# Altium project Tra_doantotnghiep.PrjPcb
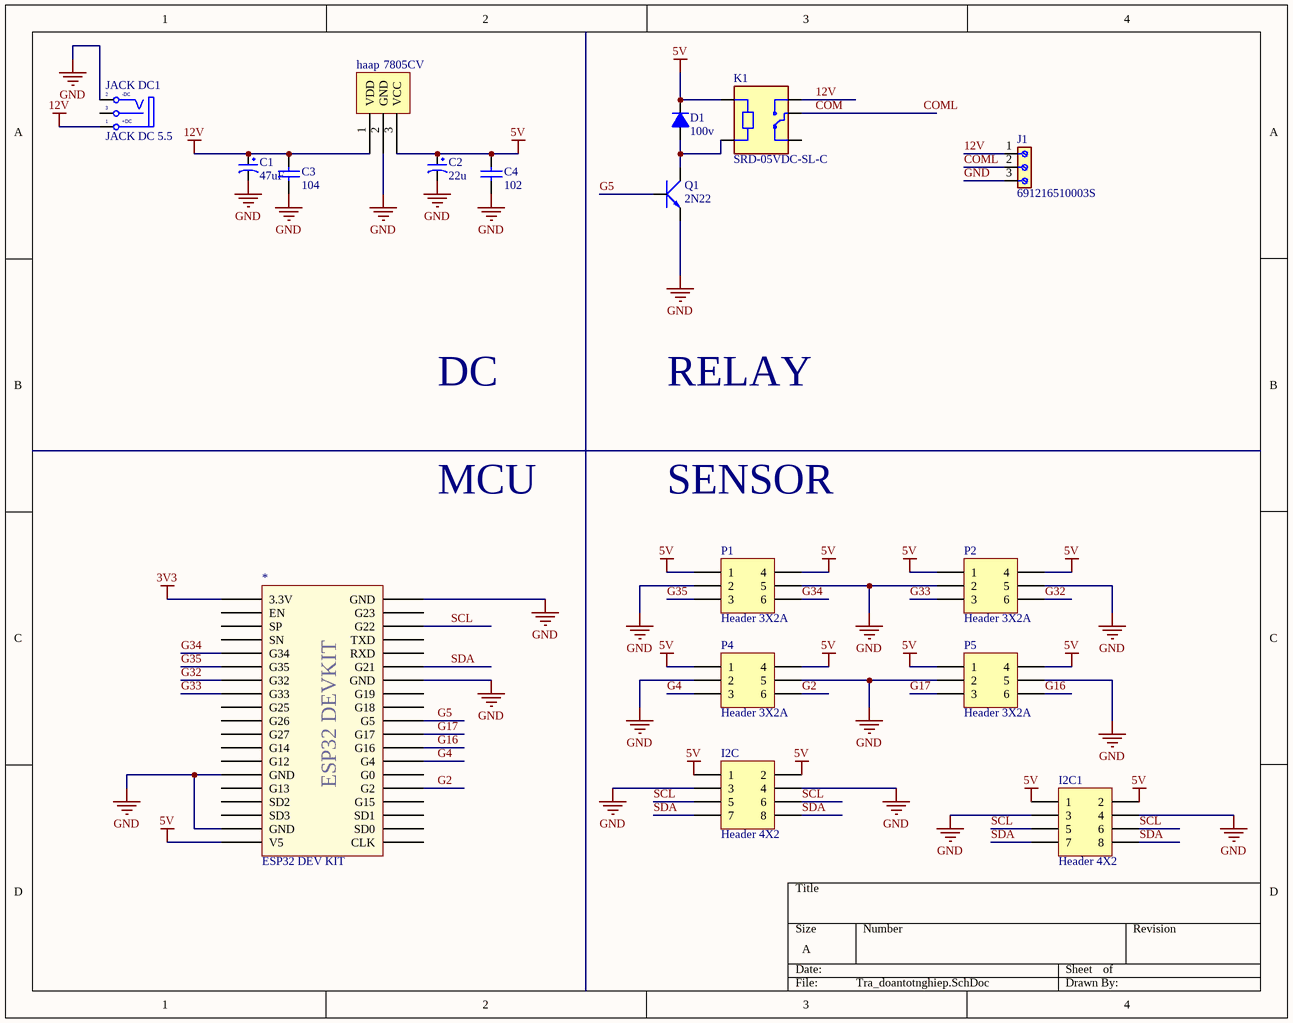
[diagram p0: Tra_doantotnghiep.SchDoc]
1 sheet, 17 parts. Net scope: global (net labels, ports and power ports of the same name join across sheets).
Board file: Tra_doantotnghiep.PcbDoc

## Sheet Tra_doantotnghiep.SchDoc
size A; PageSetup: Record=PageOptions|CenterHorizontal=True|CenterVertical=True|PrintScale=1.00|XCorrection=1.00|YCorrection=1.00|PrintKind=0|BorderSize=5000000|LeftOffset=0|BottomOffset=0|Orientation=2|PaperLength=1000|PaperWidth=1000|Scale=100|PaperSource=7|PrintQuality=-3|MediaType=1|DitherType=10|PrintScaleMode=0|PaperKind=Letter|PaperIndex=1

### Parts
*  ESP32 DEV KIT  [ESP32 DEVKIT]
C1  47uF  [tu hoa 5mm]
C2  22u  [tu hoa 5mm]
C3  104  [tu gom]
C4  102  [tu gom]
D1  100v  [DIODE 1A]
haap  7805CV  [TO-220-3]
I2C  Header 4X2  [HDR2X4]
I2C1  Header 4X2  [HDR2X4]
J1  691216510003S  [691216510003S]
JACK_DC1  JACK DC 5.5  [JACK DC 5.5]
K1  SRD-05VDC-SL-C  [RELAY_SRD-05VDC-SL-C]
P1  Header 3X2A  [HDR2X3_CEN]
P2  Header 3X2A  [HDR2X3_CEN]
P4  Header 3X2A  [HDR2X3_CEN]
P5  Header 3X2A  [HDR2X3_CEN]
Q1  2N22  [TO92]

### Nets
3V3: *.1(3.3V)
5V: *.19(V5) C2.1 C4.1 D1.2(K) haap.3(VCC) I2C.1 I2C.2 I2C1.1 I2C1.2 K1.A1 P1.1 P1.4 P2.1 P2.4 P4.1 P4.4 P5.1 P5.4
12V: C1.1 C3.1 haap.1(VDD) J1.1 JACK_DC1.1(T) K1.NO
GND: *.14(GND) *.18(GND) *.32(GND) *.38(GND) C1.2 C2.2 C3.2 C4.2 haap.2(GND) I2C.3 I2C.4 I2C1.3 I2C1.4 J1.3 JACK_DC1.2(TN) P1.2 P1.5 P2.2 P2.5 P4.2 P4.5 P5.2 P5.5 Q1.1(E)
COM: J1.2 K1.COM  [also labelled COML]
G2: *.24(G2) P4.6
G4: *.26(G4) P4.3
G5: *.29(G5) Q1.2(B)
G16: *.27(G16) P5.6
G17: *.28(G17) P5.3
G32: *.7(G32) P2.6
G33: *.8(G33) P2.3
G34: *.5(G34) P1.6
G35: *.6(G35) P1.3
SCL: *.36(G22) I2C.5 I2C.6 I2C1.5 I2C1.6
SDA: *.33(G21) I2C.7 I2C.8 I2C1.7 I2C1.8
NetD1_1: D1.1(A) K1.A2 Q1.3(C)

Not connected (* = marked no-connect by the designer): * 2(EN) 3(SP) 4(SN) 9(G25) 10(G26) 11(G27) 12(G14) 13(G12) 15(G13) 16(SD2) 17(SD3) 20(CLK) 21(SD0) 22(SD1) 23(G15) 25(G0) 30(G18) 31(G19) 34(RXD) 35(TXD) 37(G23); JACK_DC1 3(S); K1 NC

### Notes on the sheet
- DC
- RELAY
- MCU
- SENSOR
- (in symbol ESP32 DEV KIT) ESP32 DEVKIT
- (in symbol JACK DC 5.5) -DC; +DC

### Library data of the parts
C1 C2 = Tu Hoa 47uF 16V 5x10: Cắm; Don_Vi: Con; So_Chan: 2; Ten_Linh_Kien: Tụ Hóa 47uF 16V; Ma_Hang: MH006859; Chung_Loai: Cắm; Kieu_Chan: *
C3 = Tu gom 104 50V: Cắm; So_Chan: 2; Ten_Linh_Kien: Tụ gốm 104 100nF 50V; Don_Vi: Con; Ma_Hang: MH004761; Chung_Loai: Cắm; Kieu_Chan: *
C4 = Tu gom 102 50V: Cắm; Don_Vi: Con; So_Chan: 2; Ten_Linh_Kien: Tụ gốm 102 1nF 50V; Ma_Hang: MH004763; Chung_Loai: Cắm; Kieu_Chan: *
D1 = Diode 1N4007: Cắm; Ten_Linh_Kien: Diode 1N4007 1A (DIP); Don_Vi: Con; Ma_Hang: MH001063; Ghi Chu: *; Kieu_Chan: *; Chung_Loai: Cắm
I2C I2C1 = Header 4X2: Header, 4-Pin, Dual row; LatestRevisionDate: 17-Jul-2002; LatestRevisionNote: Re-released for DXP Platform.; Publisher: Altium Limited
J1 = 691216510003S: 5.08 MM TERMINAL BLOCK;; MF: WÃ¼rth Elektronik; SnapEDA_Link: https://www.snapeda.com/parts/691216510003S/W%25C3%25BCrth+Elektronik+Midcom/view-part/?ref=snap; Package: None; Value: *; MP: 691216510003S; Check_prices: https://www.snapeda.com/parts/691216510003S/W%25C3%25BCrth+Elektronik+Midcom/view-part/?ref=eda
JACK_DC1 = JACK DC 5.5: Value: Jac DC
K1 = SRD-05VDC-SL-C: 5V Trigger Relay Module For Arduino And Raspberry Pi 5V Trigger Relay Module For Arduino And Raspberry Pi; MF: Songle Relay; Check_prices: https://www.snapeda.com/parts/SRD-05VDC-SL-C/Songle+Relay/view-part/?ref=eda; Value: *; Availability: Not in stock; Price: None; Package: NON STANDARD-5 Songle Relay; MP: SRD-05VDC-SL-C; SnapEDA_Link: https://www.snapeda.com/parts/SRD-05VDC-SL-C/Songle+Relay/view-part/?ref=snap
P1 P2 P4 P5 = Header 3X2A: Header, 3-Pin, Dual row; LatestRevisionDate: 17-Jul-2002; LatestRevisionNote: Re-released for DXP Platform.; Publisher: Altium Limited
Q1 = Trans 2N3904: NPN transistor EBC; Value: C9014